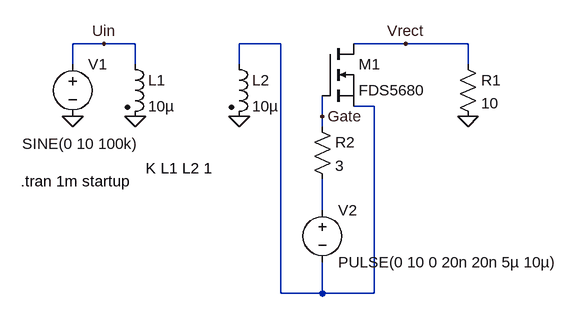
[diagram p0: schematic synchron.asc]
synchron.asc, the LTspice schematic file:
Version 4
SHEET 1 880 680
WIRE 16 96 -32 96
WIRE 64 96 16 96
WIRE 288 96 224 96
WIRE 480 96 400 96
WIRE 576 96 480 96
WIRE -32 128 -32 96
WIRE 64 128 64 96
WIRE 224 128 224 96
WIRE 576 128 576 96
WIRE 432 192 400 192
WIRE 352 208 352 176
WIRE 352 224 352 208
WIRE 352 352 352 304
WIRE 288 480 288 96
WIRE 352 480 352 432
WIRE 352 480 288 480
WIRE 432 480 432 192
WIRE 432 480 352 480
FLAG 64 208 0
FLAG -32 208 0
FLAG 224 208 0
FLAG 16 96 Uin
FLAG 576 208 0
FLAG 480 96 Vrect
FLAG 352 208 Gate
SYMBOL ind2 48 112 R0
SYMATTR InstName L1
SYMATTR Value 10µ
SYMATTR Type ind
SYMATTR SpiceLine Rser=0.001
SYMBOL ind2 208 112 R0
SYMATTR InstName L2
SYMATTR Value 10µ
SYMATTR Type ind
SYMBOL voltage -32 112 R0
WINDOW 3 -78 138 Left 0
WINDOW 123 0 0 Left 0
WINDOW 39 0 0 Left 0
SYMATTR InstName V1
SYMATTR Value SINE(0 10 100k)
SYMBOL res 560 112 R0
SYMATTR InstName R1
SYMATTR Value 10
SYMBOL nmos 352 96 R0
SYMATTR InstName M1
SYMATTR Value FDS5680
SYMBOL voltage 352 336 R0
WINDOW 123 0 0 Left 0
WINDOW 39 0 0 Left 0
SYMATTR InstName V2
SYMATTR Value PULSE(0 10 0 20n 20n 5µ 10µ)
SYMBOL res 336 208 R0
SYMATTR InstName R2
SYMATTR Value 3
TEXT 80 288 Left 0 !K L1 L2 1
TEXT -112 308 Left 0 !.tran 1m startup

The netlist it stands for:
* synchron.asc
L1 Uin 0 10µ Rser=0.001
L2 N001 0 10µ
V1 Uin 0 SINE(0 10 100k)
R1 Vrect 0 10
M1 Vrect Gate N001 N001 FDS5680
V2 N002 N001 PULSE(0 10 0 20n 20n 5µ 10µ)
R2 Gate N002 3
.model NMOS NMOS
.model PMOS PMOS
.lib standard.mos
K L1 L2 1
.tran 1m startup
.backanno
.end